# Altium schematic sheet MB1165.SchDoc: MB1165
size A3; DocumentNumber: MB1165; Revision: C.1; SheetNumber: 1; SheetTotal: 17; Project: STM32469I-EVAL
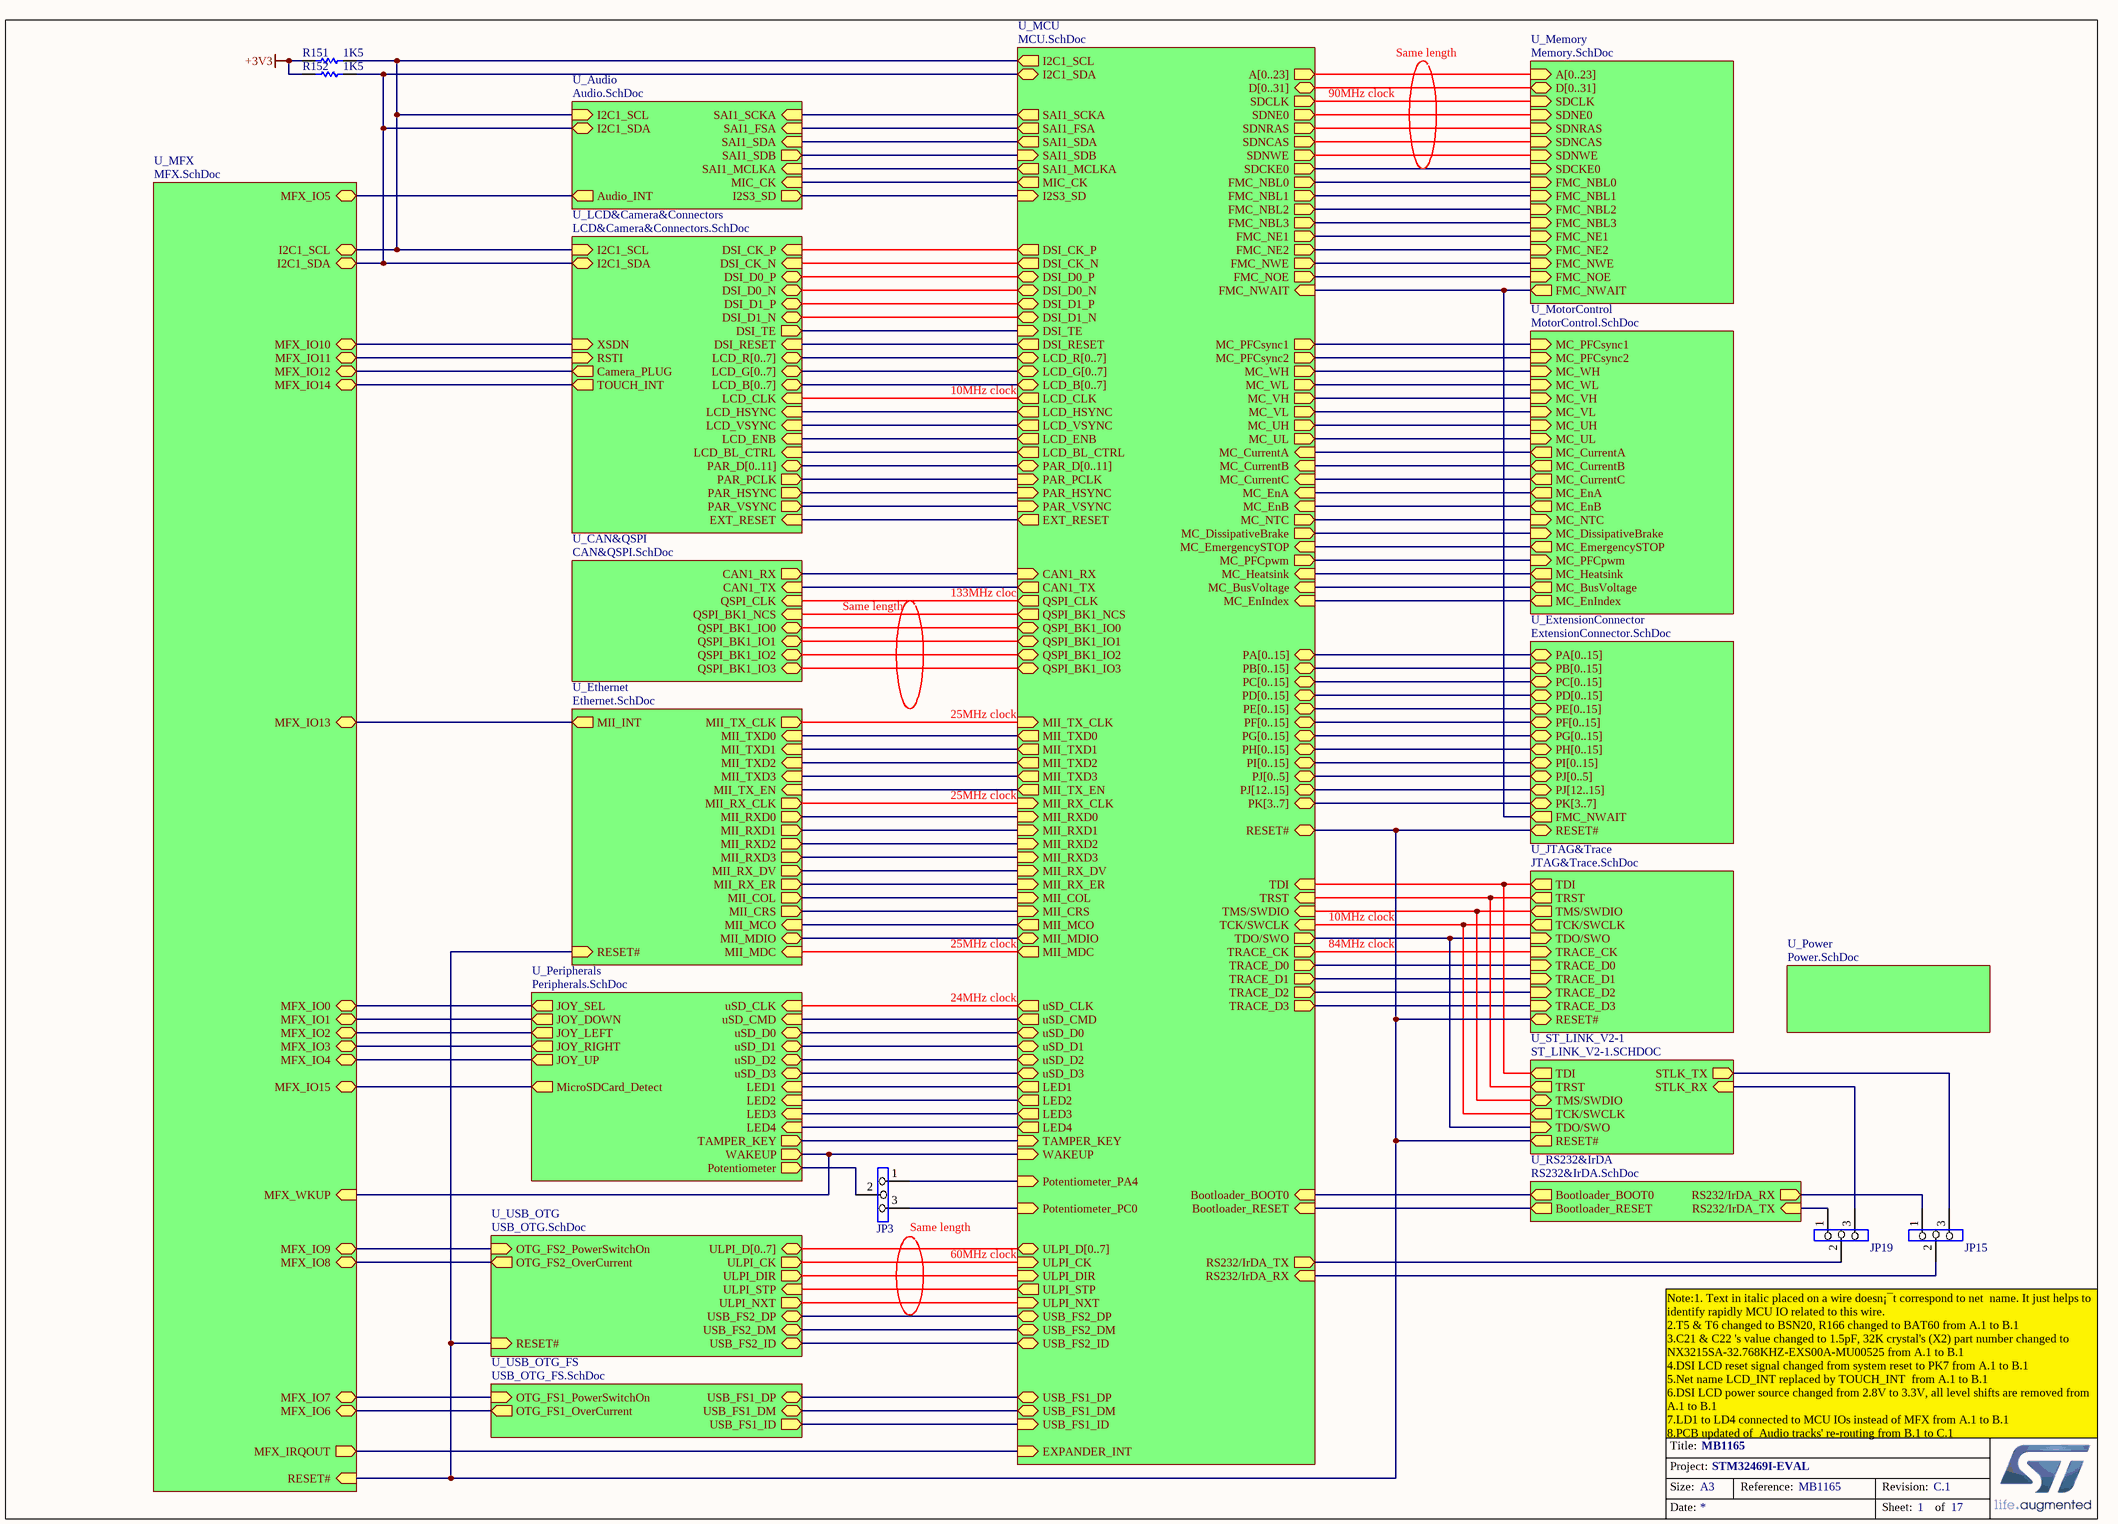
[diagram p0: MB1165.SchDoc]

## Parts
JP3  (no value)  [SIP3]
JP15  (no value)  [SIP3]
JP19  (no value)  [SIP3]
R151  1K5  [0603R]
R152  1K5  [0603R]

## Sub-sheets
U_Audio = Audio.SchDoc: SAI1_SCKA (in), SAI1_FSA (in), SAI1_SDA (in), SAI1_SDB (out), Audio_INT (out), I2C1_SDA (bidir), I2C1_SCL (in), SAI1_MCLKA (in), MIC_CK (in), I2S3_SD (out)
U_CAN&QSPI = CAN&QSPI.SchDoc: CAN1_TX (in), CAN1_RX (out), QSPI_BK1_IO0 (bidir), QSPI_BK1_IO3 (bidir), QSPI_BK1_IO2 (bidir), QSPI_BK1_IO1 (bidir), QSPI_CLK (in), QSPI_BK1_NCS (in)
U_Ethernet = Ethernet.SchDoc: MII_TXD0 (in), MII_TX_EN (in), MII_TX_CLK (out), MII_RXD0 (out), MII_RX_ER (out), MII_RX_DV (out), MII_RX_CLK (out), MII_COL (out), MII_CRS (out), MII_MDC (in), MII_MDIO (bidir), RESET# (in), MII_TXD1 (in), MII_TXD2 (in), MII_TXD3 (in), MII_RXD1 (out), MII_RXD2 (out), MII_RXD3 (out), MII_INT (out), MII_MCO (in)
U_ExtensionConnector = ExtensionConnector.SchDoc: PA[0..15] (bidir), PB[0..15] (bidir), PC[0..15] (bidir), PD[0..15] (bidir), PE[0..15] (bidir), PF[0..15] (bidir), PG[0..15] (bidir), PH[0..15] (bidir), PI[0..15] (bidir), RESET# (bidir), FMC_NWAIT (out), PJ[0..5] (bidir), PK[3..7] (bidir), PJ[12..15] (bidir)
U_JTAG&Trace = JTAG&Trace.SchDoc: TDI (out), RESET# (bidir), TRACE_D3 (in), TRACE_D2 (in), TRACE_D1 (in), TRACE_D0 (in), TRACE_CK (in), TRST (out), TMS/SWDIO (out), TCK/SWCLK (out), TDO/SWO (in)
U_LCD&Camera&Connectors = LCD&Camera&Connectors.SchDoc: LCD_R[0..7] (bidir), LCD_HSYNC (in), LCD_VSYNC (in), LCD_CLK (in), LCD_ENB (in), I2C1_SDA (bidir), I2C1_SCL (in), LCD_B[0..7] (bidir), LCD_G[0..7] (bidir), RSTI (in), XSDN (in), PAR_HSYNC (out), PAR_PCLK (out), PAR_VSYNC (out), PAR_D[0..11] (bidir), TOUCH_INT (out), Camera_PLUG (out), EXT_RESET (in), DSI_CK_P (in), DSI_CK_N (in), DSI_D0_P (bidir), DSI_D0_N (bidir), DSI_D1_P (bidir), DSI_D1_N (bidir), LCD_BL_CTRL (in), DSI_TE (out), DSI_RESET (in)
U_MCU = MCU.SchDoc: PA[0..15] (bidir), PB[0..15] (bidir), PC[0..15] (bidir), PD[0..15] (bidir), PE[0..15] (bidir), PF[0..15] (bidir), PG[0..15] (bidir), PH[0..15] (bidir), PI[0..15] (bidir), MC_EnA (in), MII_RX_CLK (in), MC_EnB (in), MII_MDIO (bidir), MC_EnIndex (in), ULPI_CK (in), MC_EmergencySTOP (in), MII_RX_DV (in), MC_UL (out), LCD_BL_CTRL (out), MC_PFCsync1 (out), RS232/IrDA_TX (out), RS232/IrDA_RX (in), USB_FS1_ID (in), CAN1_RX (in), USB_FS1_DM (bidir), MC_PFCpwm (out), CAN1_TX (out), USB_FS1_DP (bidir), MC_PFCsync2 (out), TMS/SWDIO (in), TCK/SWCLK (in), TDI (in), MC_VL (out), MC_WL (out), TDO/SWO (out), MIC_CK (out), TRST (in), I2C1_SCL (out), MII_TXD3 (out), MC_DissipativeBrake (out), I2C1_SDA (bidir), USB_FS2_ID (bidir), USB_FS2_DM (bidir), USB_FS2_DP (bidir), ULPI_STP (out), MII_MDC (out), MC_CurrentA (in), MII_TXD2 (out), MC_CurrentB (in), MII_TX_CLK (in), MC_CurrentC (in), MII_RXD0 (in), MC_BusVoltage (in), MII_RXD1 (in), MC_Heatsink (in), MC_UH (out), MC_VH (out), uSD_D0 (bidir), MC_WH (out), uSD_D1 (bidir), uSD_D2 (bidir), EXT_RESET (out), uSD_D3 (bidir), uSD_CLK (out), TAMPER_KEY (in), MII_CRS (in), LCD_ENB (out), uSD_CMD (out), FMC_NOE (out), FMC_NWE (out), FMC_NWAIT (in), I2S3_SD (in), FMC_NE1 (out), FMC_NBL3 (out), FMC_NBL2 (out), EXPANDER_INT (in), MII_RX_ER (in), ULPI_DIR (in), LCD_HSYNC (out), LCD_VSYNC (out), LCD_CLK (out), FMC_NBL0 (out), FMC_NBL1 (out), TRACE_CK (out), TRACE_D0 (out), TRACE_D2 (out), TRACE_D1 (out), SAI1_SDA (out), TRACE_D3 (out), SAI1_SDB (in), SAI1_SCKA (out), SAI1_FSA (out), SAI1_MCLKA (out), SDNRAS (out), SDCLK (out), FMC_NE2 (out), MII_TX_EN (out), MC_NTC (out), MII_TXD1 (out), SDNCAS (out), SDCKE0 (out), SDNE0 (out), MII_COL (in), ULPI_NXT (in), SDNWE (out), MII_RXD2 (in), MII_RXD3 (in), LCD_G[0..7] (bidir), LCD_B[0..7] (bidir), D[0..31] (bidir), A[0..23] (out), ULPI_D[0..7] (bidir), RESET# (bidir), PJ[0..5] (bidir), PK[3..7] (bidir), PAR_VSYNC (in), PAR_D[0..11] (bidir), PAR_PCLK (in), PAR_HSYNC (in), MII_MCO (out), LCD_R[0..7] (bidir), Bootloader_BOOT0 (in), QSPI_CLK (out), QSPI_BK1_NCS (out), QSPI_BK1_IO3 (bidir), QSPI_BK1_IO2 (bidir), QSPI_BK1_IO1 (bidir), QSPI_BK1_IO0 (bidir), Bootloader_RESET (in), WAKEUP (in), Potentiometer_PA4 (in), MII_TXD0 (out), Potentiometer_PC0 (in), DSI_TE (in), DSI_CK_P (out), DSI_CK_N (out), DSI_D0_P (bidir), DSI_D0_N (bidir), DSI_D1_P (bidir), DSI_D1_N (bidir), PJ[12..15] (bidir), DSI_RESET (out), LED1 (out), LED2 (out), LED3 (out), LED4 (out)
U_Memory = Memory.SchDoc: FMC_NE1 (in), FMC_NWE (in), FMC_NOE (in), FMC_NWAIT (out), FMC_NBL0 (in), FMC_NBL1 (in), D[0..31] (bidir), A[0..23] (in), SDNCAS (in), SDNWE (in), SDNRAS (in), SDNE0 (in), SDCKE0 (in), SDCLK (in), FMC_NBL3 (in), FMC_NBL2 (in), FMC_NE2 (in)
U_MFX = MFX.SchDoc: MFX_IRQOUT (out), I2C1_SDA (bidir), I2C1_SCL (bidir), MFX_IO5 (bidir), MFX_IO6 (bidir), MFX_IO7 (bidir), MFX_IO8 (bidir), MFX_IO9 (bidir), MFX_IO10 (bidir), MFX_IO11 (bidir), MFX_IO12 (bidir), MFX_IO13 (bidir), MFX_IO14 (bidir), MFX_IO15 (bidir), MFX_WKUP (in), MFX_IO0 (bidir), MFX_IO1 (bidir), MFX_IO2 (bidir), MFX_IO3 (bidir), MFX_IO4 (bidir), RESET# (in)
U_MotorControl = MotorControl.SchDoc: MC_EmergencySTOP (out), MC_CurrentA (out), MC_CurrentB (out), MC_CurrentC (out), MC_PFCsync1 (in), MC_PFCsync2 (in), MC_WL (in), MC_VH (in), MC_VL (in), MC_UH (in), MC_UL (in), MC_WH (in), MC_NTC (in), MC_DissipativeBrake (in), MC_PFCpwm (in), MC_EnA (out), MC_EnB (out), MC_Heatsink (out), MC_BusVoltage (out), MC_EnIndex (out)
U_Peripherals = Peripherals.SchDoc: JOY_SEL (out), JOY_DOWN (out), JOY_LEFT (out), JOY_RIGHT (out), JOY_UP (out), uSD_CLK (in), uSD_CMD (in), uSD_D0 (bidir), uSD_D1 (bidir), uSD_D2 (bidir), uSD_D3 (bidir), MicroSDCard_Detect (out), TAMPER_KEY (out), WAKEUP (out), Potentiometer (out), LED4 (in), LED3 (in), LED1 (in), LED2 (in)
U_Power = Power.SchDoc: no entries
U_RS232&IrDA = RS232&IrDA.SchDoc: RS232/IrDA_TX (in), RS232/IrDA_RX (out), Bootloader_BOOT0 (out), Bootloader_RESET (out)
U_ST_LINK_V2-1 = ST_LINK_V2-1.SCHDOC: STLK_RX (in), STLK_TX (out), TDI (out), TRST (out), TMS/SWDIO (bidir), TCK/SWCLK (out), TDO/SWO (in), RESET# (out)
U_USB_OTG = USB_OTG.SchDoc: ULPI_D[0..7] (bidir), ULPI_CK (out), ULPI_DIR (out), ULPI_NXT (out), ULPI_STP (in), RESET# (in), USB_FS2_DM (bidir), USB_FS2_DP (bidir), OTG_FS2_PowerSwitchOn (in), OTG_FS2_OverCurrent (out), USB_FS2_ID (bidir)
U_USB_OTG_FS = USB_OTG_FS.SchDoc: OTG_FS1_PowerSwitchOn (in), OTG_FS1_OverCurrent (out), USB_FS1_DM (bidir), USB_FS1_DP (bidir), USB_FS1_ID (out)

## Nets
+3V3: R151.1 R152.1
NetJP3_1: JP3.1 ; sheet U_MCU/Potentiometer_PA4
NetJP3_2: JP3.2 ; sheet U_Peripherals/Potentiometer
NetJP3_3: JP3.3 ; sheet U_MCU/Potentiometer_PC0
NetJP15_1: JP15.1 ; sheet U_RS232&IrDA/RS232/IrDA_RX
NetJP15_2: JP15.2 ; sheet U_MCU/RS232/IrDA_RX
NetJP15_3: JP15.3 ; sheet U_ST_LINK_V2-1/STLK_TX
NetJP19_1: JP19.1 ; sheet U_RS232&IrDA/RS232/IrDA_TX
NetJP19_2: JP19.2 ; sheet U_MCU/RS232/IrDA_TX
NetJP19_3: JP19.3 ; sheet U_ST_LINK_V2-1/STLK_RX
NetR151_2: R151.2 ; sheet U_Audio/I2C1_SCL, sheet U_MFX/I2C1_SCL, sheet U_MCU/I2C1_SCL, sheet U_LCD&Camera&Connectors/I2C1_SCL
NetR152_2: R152.2 ; sheet U_Audio/I2C1_SDA, sheet U_MFX/I2C1_SDA, sheet U_MCU/I2C1_SDA, sheet U_LCD&Camera&Connectors/I2C1_SDA
(unnamed): sheet U_Audio/SAI1_SCKA, sheet U_MCU/SAI1_SCKA
(unnamed): sheet U_Audio/SAI1_FSA, sheet U_MCU/SAI1_FSA
(unnamed): sheet U_Audio/SAI1_SDA, sheet U_MCU/SAI1_SDA
(unnamed): sheet U_Audio/SAI1_SDB, sheet U_MCU/SAI1_SDB
(unnamed): sheet U_Audio/Audio_INT, sheet U_MFX/MFX_IO5
(unnamed): sheet U_Audio/SAI1_MCLKA, sheet U_MCU/SAI1_MCLKA
(unnamed): sheet U_Audio/MIC_CK, sheet U_MCU/MIC_CK
(unnamed): sheet U_Audio/I2S3_SD, sheet U_MCU/I2S3_SD
(unnamed): sheet U_CAN&QSPI/CAN1_TX, sheet U_MCU/CAN1_TX
(unnamed): sheet U_CAN&QSPI/CAN1_RX, sheet U_MCU/CAN1_RX
(unnamed): sheet U_CAN&QSPI/QSPI_BK1_IO0, sheet U_MCU/QSPI_BK1_IO0
(unnamed): sheet U_CAN&QSPI/QSPI_BK1_IO3, sheet U_MCU/QSPI_BK1_IO3
(unnamed): sheet U_CAN&QSPI/QSPI_BK1_IO2, sheet U_MCU/QSPI_BK1_IO2
(unnamed): sheet U_CAN&QSPI/QSPI_BK1_IO1, sheet U_MCU/QSPI_BK1_IO1
(unnamed): sheet U_CAN&QSPI/QSPI_CLK, sheet U_MCU/QSPI_CLK
(unnamed): sheet U_CAN&QSPI/QSPI_BK1_NCS, sheet U_MCU/QSPI_BK1_NCS
(unnamed): sheet U_Ethernet/MII_TXD0, sheet U_MCU/MII_TXD0
(unnamed): sheet U_Ethernet/MII_TX_EN, sheet U_MCU/MII_TX_EN
(unnamed): sheet U_Ethernet/MII_TX_CLK, sheet U_MCU/MII_TX_CLK
(unnamed): sheet U_Ethernet/MII_RXD0, sheet U_MCU/MII_RXD0
(unnamed): sheet U_Ethernet/MII_RX_ER, sheet U_MCU/MII_RX_ER
(unnamed): sheet U_Ethernet/MII_RX_DV, sheet U_MCU/MII_RX_DV
(unnamed): sheet U_Ethernet/MII_RX_CLK, sheet U_MCU/MII_RX_CLK
(unnamed): sheet U_Ethernet/MII_COL, sheet U_MCU/MII_COL
(unnamed): sheet U_Ethernet/MII_CRS, sheet U_MCU/MII_CRS
(unnamed): sheet U_Ethernet/MII_MDC, sheet U_MCU/MII_MDC
(unnamed): sheet U_Ethernet/MII_MDIO, sheet U_MCU/MII_MDIO
(unnamed): sheet U_Ethernet/RESET#, sheet U_ExtensionConnector/RESET#, sheet U_JTAG&Trace/RESET#, sheet U_ST_LINK_V2-1/RESET#, sheet U_USB_OTG/RESET#, sheet U_MFX/RESET#, sheet U_MCU/RESET#
(unnamed): sheet U_Ethernet/MII_TXD1, sheet U_MCU/MII_TXD1
(unnamed): sheet U_Ethernet/MII_TXD2, sheet U_MCU/MII_TXD2
(unnamed): sheet U_Ethernet/MII_TXD3, sheet U_MCU/MII_TXD3
(unnamed): sheet U_Ethernet/MII_RXD1, sheet U_MCU/MII_RXD1
(unnamed): sheet U_Ethernet/MII_RXD2, sheet U_MCU/MII_RXD2
(unnamed): sheet U_Ethernet/MII_RXD3, sheet U_MCU/MII_RXD3
(unnamed): sheet U_Ethernet/MII_INT, sheet U_MFX/MFX_IO13
(unnamed): sheet U_Ethernet/MII_MCO, sheet U_MCU/MII_MCO
(unnamed): sheet U_ExtensionConnector/FMC_NWAIT, sheet U_Memory/FMC_NWAIT, sheet U_MCU/FMC_NWAIT
(unnamed): sheet U_JTAG&Trace/TDI, sheet U_ST_LINK_V2-1/TDI, sheet U_MCU/TDI
(unnamed): sheet U_JTAG&Trace/TRACE_D3, sheet U_MCU/TRACE_D3
(unnamed): sheet U_JTAG&Trace/TRACE_D2, sheet U_MCU/TRACE_D2
(unnamed): sheet U_JTAG&Trace/TRACE_D1, sheet U_MCU/TRACE_D1
(unnamed): sheet U_JTAG&Trace/TRACE_D0, sheet U_MCU/TRACE_D0
(unnamed): sheet U_JTAG&Trace/TRACE_CK, sheet U_MCU/TRACE_CK
(unnamed): sheet U_JTAG&Trace/TRST, sheet U_ST_LINK_V2-1/TRST, sheet U_MCU/TRST
(unnamed): sheet U_JTAG&Trace/TMS/SWDIO, sheet U_ST_LINK_V2-1/TMS/SWDIO, sheet U_MCU/TMS/SWDIO
(unnamed): sheet U_JTAG&Trace/TCK/SWCLK, sheet U_ST_LINK_V2-1/TCK/SWCLK, sheet U_MCU/TCK/SWCLK
(unnamed): sheet U_JTAG&Trace/TDO/SWO, sheet U_ST_LINK_V2-1/TDO/SWO, sheet U_MCU/TDO/SWO
(unnamed): sheet U_Memory/FMC_NE1, sheet U_MCU/FMC_NE1
(unnamed): sheet U_Memory/FMC_NWE, sheet U_MCU/FMC_NWE
(unnamed): sheet U_Memory/FMC_NOE, sheet U_MCU/FMC_NOE
(unnamed): sheet U_Memory/FMC_NBL0, sheet U_MCU/FMC_NBL0
(unnamed): sheet U_Memory/FMC_NBL1, sheet U_MCU/FMC_NBL1
(unnamed): sheet U_Memory/SDNCAS, sheet U_MCU/SDNCAS
(unnamed): sheet U_Memory/SDNWE, sheet U_MCU/SDNWE
(unnamed): sheet U_Memory/SDNRAS, sheet U_MCU/SDNRAS
(unnamed): sheet U_Memory/SDNE0, sheet U_MCU/SDNE0
(unnamed): sheet U_Memory/SDCKE0, sheet U_MCU/SDCKE0
(unnamed): sheet U_Memory/SDCLK, sheet U_MCU/SDCLK
(unnamed): sheet U_Memory/FMC_NBL3, sheet U_MCU/FMC_NBL3
(unnamed): sheet U_Memory/FMC_NBL2, sheet U_MCU/FMC_NBL2
(unnamed): sheet U_Memory/FMC_NE2, sheet U_MCU/FMC_NE2
(unnamed): sheet U_MotorControl/MC_EmergencySTOP, sheet U_MCU/MC_EmergencySTOP
(unnamed): sheet U_MotorControl/MC_CurrentA, sheet U_MCU/MC_CurrentA
(unnamed): sheet U_MotorControl/MC_CurrentB, sheet U_MCU/MC_CurrentB
(unnamed): sheet U_MotorControl/MC_CurrentC, sheet U_MCU/MC_CurrentC
(unnamed): sheet U_MotorControl/MC_PFCsync1, sheet U_MCU/MC_PFCsync1
(unnamed): sheet U_MotorControl/MC_PFCsync2, sheet U_MCU/MC_PFCsync2
(unnamed): sheet U_MotorControl/MC_WL, sheet U_MCU/MC_WL
(unnamed): sheet U_MotorControl/MC_VH, sheet U_MCU/MC_VH
(unnamed): sheet U_MotorControl/MC_VL, sheet U_MCU/MC_VL
(unnamed): sheet U_MotorControl/MC_UH, sheet U_MCU/MC_UH
(unnamed): sheet U_MotorControl/MC_UL, sheet U_MCU/MC_UL
(unnamed): sheet U_MotorControl/MC_WH, sheet U_MCU/MC_WH
(unnamed): sheet U_MotorControl/MC_NTC, sheet U_MCU/MC_NTC
(unnamed): sheet U_MotorControl/MC_DissipativeBrake, sheet U_MCU/MC_DissipativeBrake
(unnamed): sheet U_MotorControl/MC_PFCpwm, sheet U_MCU/MC_PFCpwm
(unnamed): sheet U_MotorControl/MC_EnA, sheet U_MCU/MC_EnA
(unnamed): sheet U_MotorControl/MC_EnB, sheet U_MCU/MC_EnB
(unnamed): sheet U_MotorControl/MC_Heatsink, sheet U_MCU/MC_Heatsink
(unnamed): sheet U_MotorControl/MC_BusVoltage, sheet U_MCU/MC_BusVoltage
(unnamed): sheet U_MotorControl/MC_EnIndex, sheet U_MCU/MC_EnIndex
(unnamed): sheet U_RS232&IrDA/Bootloader_BOOT0, sheet U_MCU/Bootloader_BOOT0
(unnamed): sheet U_RS232&IrDA/Bootloader_RESET, sheet U_MCU/Bootloader_RESET
(unnamed): sheet U_USB_OTG/ULPI_CK, sheet U_MCU/ULPI_CK
(unnamed): sheet U_USB_OTG/ULPI_DIR, sheet U_MCU/ULPI_DIR
(unnamed): sheet U_USB_OTG/ULPI_NXT, sheet U_MCU/ULPI_NXT
(unnamed): sheet U_USB_OTG/ULPI_STP, sheet U_MCU/ULPI_STP
(unnamed): sheet U_USB_OTG/USB_FS2_DM, sheet U_MCU/USB_FS2_DM
(unnamed): sheet U_USB_OTG/USB_FS2_DP, sheet U_MCU/USB_FS2_DP
(unnamed): sheet U_USB_OTG/OTG_FS2_PowerSwitchOn, sheet U_MFX/MFX_IO9
(unnamed): sheet U_USB_OTG/OTG_FS2_OverCurrent, sheet U_MFX/MFX_IO8
(unnamed): sheet U_USB_OTG/USB_FS2_ID, sheet U_MCU/USB_FS2_ID
(unnamed): sheet U_USB_OTG_FS/OTG_FS1_PowerSwitchOn, sheet U_MFX/MFX_IO7
(unnamed): sheet U_USB_OTG_FS/OTG_FS1_OverCurrent, sheet U_MFX/MFX_IO6
(unnamed): sheet U_USB_OTG_FS/USB_FS1_DM, sheet U_MCU/USB_FS1_DM
(unnamed): sheet U_USB_OTG_FS/USB_FS1_DP, sheet U_MCU/USB_FS1_DP
(unnamed): sheet U_USB_OTG_FS/USB_FS1_ID, sheet U_MCU/USB_FS1_ID
(unnamed): sheet U_MFX/MFX_IRQOUT, sheet U_MCU/EXPANDER_INT
(unnamed): sheet U_MFX/MFX_IO10, sheet U_LCD&Camera&Connectors/XSDN
(unnamed): sheet U_MFX/MFX_IO11, sheet U_LCD&Camera&Connectors/RSTI
(unnamed): sheet U_MFX/MFX_IO12, sheet U_LCD&Camera&Connectors/Camera_PLUG
(unnamed): sheet U_MFX/MFX_IO14, sheet U_LCD&Camera&Connectors/TOUCH_INT
(unnamed): sheet U_MFX/MFX_IO15, sheet U_Peripherals/MicroSDCard_Detect
(unnamed): sheet U_MFX/MFX_WKUP, sheet U_MCU/WAKEUP, sheet U_Peripherals/WAKEUP
(unnamed): sheet U_MFX/MFX_IO0, sheet U_Peripherals/JOY_SEL
(unnamed): sheet U_MFX/MFX_IO1, sheet U_Peripherals/JOY_DOWN
(unnamed): sheet U_MFX/MFX_IO2, sheet U_Peripherals/JOY_LEFT
(unnamed): sheet U_MFX/MFX_IO3, sheet U_Peripherals/JOY_RIGHT
(unnamed): sheet U_MFX/MFX_IO4, sheet U_Peripherals/JOY_UP
(unnamed): sheet U_MCU/LCD_BL_CTRL, sheet U_LCD&Camera&Connectors/LCD_BL_CTRL
(unnamed): sheet U_MCU/uSD_D0, sheet U_Peripherals/uSD_D0
(unnamed): sheet U_MCU/uSD_D1, sheet U_Peripherals/uSD_D1
(unnamed): sheet U_MCU/uSD_D2, sheet U_Peripherals/uSD_D2
(unnamed): sheet U_MCU/EXT_RESET, sheet U_LCD&Camera&Connectors/EXT_RESET
(unnamed): sheet U_MCU/uSD_D3, sheet U_Peripherals/uSD_D3
(unnamed): sheet U_MCU/uSD_CLK, sheet U_Peripherals/uSD_CLK
(unnamed): sheet U_MCU/TAMPER_KEY, sheet U_Peripherals/TAMPER_KEY
(unnamed): sheet U_MCU/LCD_ENB, sheet U_LCD&Camera&Connectors/LCD_ENB
(unnamed): sheet U_MCU/uSD_CMD, sheet U_Peripherals/uSD_CMD
(unnamed): sheet U_MCU/LCD_HSYNC, sheet U_LCD&Camera&Connectors/LCD_HSYNC
(unnamed): sheet U_MCU/LCD_VSYNC, sheet U_LCD&Camera&Connectors/LCD_VSYNC
(unnamed): sheet U_MCU/LCD_CLK, sheet U_LCD&Camera&Connectors/LCD_CLK
(unnamed): sheet U_MCU/PAR_VSYNC, sheet U_LCD&Camera&Connectors/PAR_VSYNC
(unnamed): sheet U_MCU/PAR_PCLK, sheet U_LCD&Camera&Connectors/PAR_PCLK
(unnamed): sheet U_MCU/PAR_HSYNC, sheet U_LCD&Camera&Connectors/PAR_HSYNC
(unnamed): sheet U_MCU/DSI_TE, sheet U_LCD&Camera&Connectors/DSI_TE
(unnamed): sheet U_MCU/DSI_CK_P, sheet U_LCD&Camera&Connectors/DSI_CK_P
(unnamed): sheet U_MCU/DSI_CK_N, sheet U_LCD&Camera&Connectors/DSI_CK_N
(unnamed): sheet U_MCU/DSI_D0_P, sheet U_LCD&Camera&Connectors/DSI_D0_P
(unnamed): sheet U_MCU/DSI_D0_N, sheet U_LCD&Camera&Connectors/DSI_D0_N
(unnamed): sheet U_MCU/DSI_D1_P, sheet U_LCD&Camera&Connectors/DSI_D1_P
(unnamed): sheet U_MCU/DSI_D1_N, sheet U_LCD&Camera&Connectors/DSI_D1_N
(unnamed): sheet U_MCU/DSI_RESET, sheet U_LCD&Camera&Connectors/DSI_RESET
(unnamed): sheet U_MCU/LED1, sheet U_Peripherals/LED1
(unnamed): sheet U_MCU/LED2, sheet U_Peripherals/LED2
(unnamed): sheet U_MCU/LED3, sheet U_Peripherals/LED3
(unnamed): sheet U_MCU/LED4, sheet U_Peripherals/LED4

## Buses and harness runs
bus sheet U_ExtensionConnector/PA[0..15] = sheet U_MCU/PA[0..15]
bus sheet U_ExtensionConnector/PB[0..15] = sheet U_MCU/PB[0..15]
bus sheet U_ExtensionConnector/PC[0..15] = sheet U_MCU/PC[0..15]
bus sheet U_ExtensionConnector/PD[0..15] = sheet U_MCU/PD[0..15]
bus sheet U_ExtensionConnector/PE[0..15] = sheet U_MCU/PE[0..15]
bus sheet U_ExtensionConnector/PF[0..15] = sheet U_MCU/PF[0..15]
bus sheet U_ExtensionConnector/PG[0..15] = sheet U_MCU/PG[0..15]
bus sheet U_ExtensionConnector/PH[0..15] = sheet U_MCU/PH[0..15]
bus sheet U_ExtensionConnector/PI[0..15] = sheet U_MCU/PI[0..15]
bus sheet U_ExtensionConnector/PJ[0..5] = sheet U_MCU/PJ[0..5]
bus sheet U_ExtensionConnector/PJ[12..15] = sheet U_MCU/PJ[12..15]
bus sheet U_ExtensionConnector/PK[3..7] = sheet U_MCU/PK[3..7]
bus sheet U_LCD&Camera&Connectors/LCD_B[0..7] = sheet U_MCU/LCD_B[0..7]
bus sheet U_LCD&Camera&Connectors/LCD_G[0..7] = sheet U_MCU/LCD_G[0..7]
bus sheet U_LCD&Camera&Connectors/LCD_R[0..7] = sheet U_MCU/LCD_R[0..7]
bus sheet U_LCD&Camera&Connectors/PAR_D[0..11] = sheet U_MCU/PAR_D[0..11]
bus sheet U_MCU/A[0..23] = sheet U_Memory/A[0..23]
bus sheet U_MCU/D[0..31] = sheet U_Memory/D[0..31]
bus sheet U_MCU/ULPI_D[0..7] = sheet U_USB_OTG/ULPI_D[0..7]

## Notes on the sheet
- Same length
- 90MHz clock
- 10MHz clock
- 133MHz clock
- 25MHz clock
- 24MHz clock
- 84MHz clock
- (near JP3) Same length
- 60MHz clock
- Note:1. Text in italic placed on a wire doesn¡¯t correspond to net  name. It just helps to identify rapidly MCU IO related to this wire.
  2.T5 & T6 changed to BSN20, R166 changed to BAT60 from A.1 to B.1
  3.C21 & C22 's value changed to 1.5pF, 32K crystal's (X2) part number changed to NX3215SA-32.768KHZ-EXS00A-MU00525 from A.1 to B.1
  4.DSI LCD reset signal changed from system reset to PK7 from A.1 to B.1
  5.Net name LCD_INT replaced by TOUCH_INT  from A.1 to B.1
  6.DSI LCD power source changed from 2.8V to 3.3V, all level shifts are removed from A.1 to B.1
  7.LD1 to LD4 connected to MCU IOs instead of MFX from A.1 to B.1
  8.PCB updated of  Audio tracks' re-routing from B.1 to C.1
- Title:
- Project:
- Size:
- Date:
- A3
- Reference:
- Sheet:
- Revision:
- of

## Library data of the parts
JP3 JP15 JP19 = Jumper3
R151 R152 = Res1: Resistor; Value: 1K; Published: 8-Jun-2000; Revision: July-2002: Re-released for DXP Platform.; Publisher: Altium Limited